# Altium schematic sheet EE311_Example_Boost_Sch.SchDoc: ELECTENG 311 - Boost Converter
size A3; Author: Duleepa J Thrimawithana; Organization: Power Electronics Group; Address1: The University of Auckland; Address2: 20 Symonds Street; Address3: Auckland 1010; Address4: New Zealand; Revision: 1R1; SheetNumber: 1; SheetTotal: 1
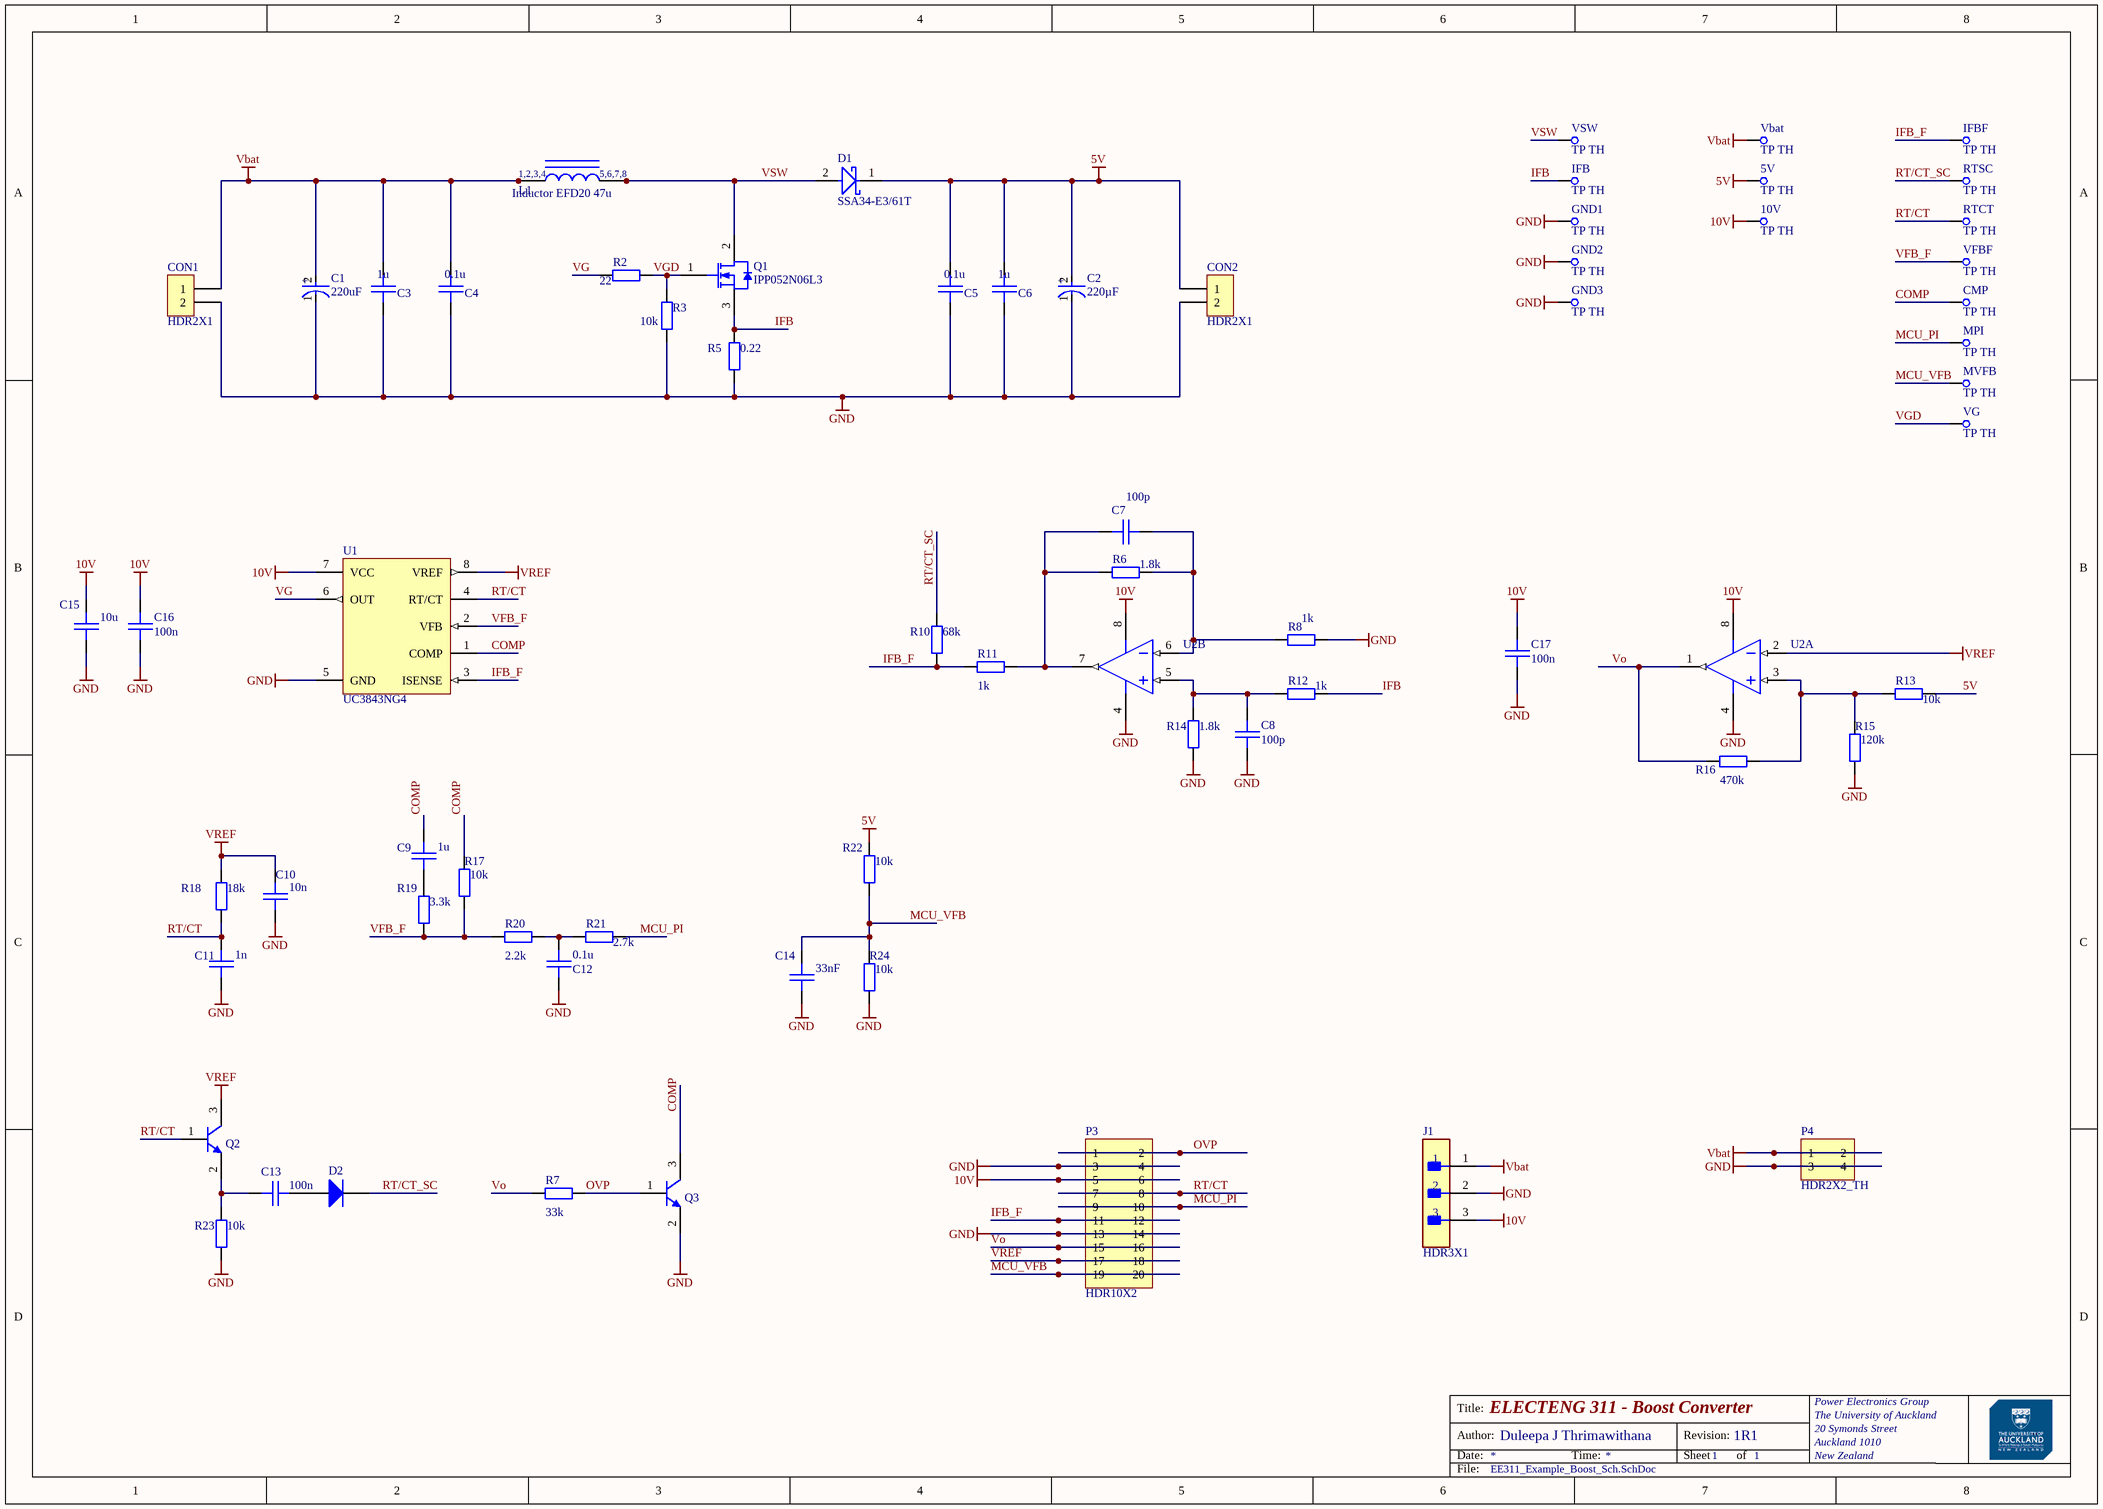
[diagram p0: EE311_Example_Boost_Sch.SchDoc]

## Parts
5V  TP TH  [TP_TH_2.5mm]
10V  TP TH  [TP_TH_2.5mm]
C1  value 220uF  [FP-FKF-MFG]  (hidden comment: EEE-FK1K330P)
C2  value 220µF  [FP-FKF-MFG]  (hidden comment: EEE-FK1K330P)
C3  1u  [C1210]
C4  0.1u  [C1210]
C5  0.1u  [C1210]
C6  1u  [C1210]
C7  value 100p  [C0805]  (hidden comment: CCAP0805)
C8  value 100p  [C0805]  (hidden comment: CCAP0805)
C9  value 1u  [C0805]  (hidden comment: CCAP0805)
C10  value 10n  [C0805]  (hidden comment: CCAP0805)
C11  value 1n  [C0805]  (hidden comment: CCAP0805)
C12  value 0.1u  [C0805]  (hidden comment: CCAP0805)
C13  value 100n  [C0805]  (hidden comment: CCAP0805)
C14  value 33nF  [C0805]  (hidden comment: CCAP0805)
C15  value 10u  [C0805]  (hidden comment: CCAP0805)
C16  value 100n  [C0805]  (hidden comment: CCAP0805)
C17  value 100n  [C0805]  (hidden comment: CCAP0805)
CMP  TP TH  [TP_TH_2.5mm]
CON1  HDR2X1  [HDR2X1_2P54]
CON2  HDR2X1  [HDR2X1_2P54]
D1  SSA34-E3/61T  [FP-95400-MFG]
D2  1N4148_SMT_SOD123  [SOD123]  (value not drawn)
GND1  TP TH  [TP_TH_3mm]
GND2  TP TH  [TP_TH_3mm]
GND3  TP TH  [TP_TH_3mm]
IFB  TP TH  [TP_TH_3mm]
IFBF  TP TH  [TP_TH_2.5mm]
J1  HDR3X1  [FP-22-28-4035-MFG]
L1  Inductor EFD20 47u  [EFD20]
MPI  TP TH  [TP_TH_2.5mm]
MVFB  TP TH  [TP_TH_2.5mm]
P3  HDR10X2  [HDR10X2_2P54]
P4  HDR2X2_TH  [HDR2X2_2P54_Male]
Q1  IPP052N06L3  [TO220VH]
Q2  MMBT2222A  [SOT23SM]  (value not drawn)
Q3  MMBT2222A  [SOT23SM]  (value not drawn)
R2  value 22  [R0805]  (hidden comment: RES0805)
R3  value 10k  [R0805]  (hidden comment: RES0805)
R5  value 0.22  [R1210]  (hidden comment: RES1210)
R6  value 1.8k  [R0805]  (hidden comment: RES0805)
R7  value 33k  [R0805]  (hidden comment: RES0805)
R8  value 1k  [R0805]  (hidden comment: RES0805)
R10  value 68k  [R0805]  (hidden comment: RES0805)
R11  value 1k  [R0805]  (hidden comment: RES0805)
R12  value 1k  [R0805]  (hidden comment: RES0805)
R13  value 10k  [R0805]  (hidden comment: RES0805)
R14  value 1.8k  [R0805]  (hidden comment: RES0805)
R15  value 120k  [R0805]  (hidden comment: RES0805)
R16  value 470k  [R0805]  (hidden comment: RES0805)
R17  value 10k  [R0805]  (hidden comment: RES0805)
R18  value 18k  [R0805]  (hidden comment: RES0805)
R19  value 3.3k  [R0805]  (hidden comment: RES0805)
R20  value 2.2k  [R0805]  (hidden comment: RES0805)
R21  value 2.7k  [R0805]  (hidden comment: RES0805)
R22  value 10k  [R0805]  (hidden comment: RES0805)
R23  value 10k  [R0805]  (hidden comment: RES0805)
R24  value 10k  [R0805]  (hidden comment: RES0805)
RTCT  TP TH  [TP_TH_2.5mm]
RTSC  TP TH  [TP_TH_2.5mm]
U1  UC3843NG4  [DIP-8]
U2  LT6221  [SOIC8]  (value not drawn)  (parts A,B of 2)
Vbat  TP TH  [TP_TH_2.5mm]
VFBF  TP TH  [TP_TH_2.5mm]
VG  TP TH  [TP_TH_2.5mm]
VSW  TP TH  [TP_TH_3mm]

## Nets
5V: 5V.1 C2.2(A) C5.2 C6.2 CON2.1 D1.1(C) R13.2 R22.2
10V: 10V.1 C15.1 C16.1 C17.1 J1.3 P3.5 P3.6 U1.7(VCC) U2.8(VDD)
GND: C1.1(C) C2.1(C) C3.1 C4.1 C5.1 C6.1 C8.2 C10.2 C11.2 C12.2 C14.2 C15.2 C16.2 C17.2 CON1.2 CON2.2 GND1.1 GND2.1 GND3.1 J1.2 P3.3 P3.4 P3.13 P3.14 P4.3 P4.4 Q3.2(E) R3.1 R5.1 R8.2 R14.1 R15.1 R23.2 R24.1 U1.5(GND) U2.4(GND)
Vbat: C1.2(A) C3.2 C4.2 CON1.1 J1.1 L1.1 L1.2 L1.3 L1.4 P4.1 P4.2 Vbat.1
VREF: C10.1 P3.17 P3.18 Q2.3(C) R18.2 U1.8(VREF) U2.2(IN1-)
COMP: C9.1 CMP.1 Q3.3(C) R17.2 U1.1(COMP)
IFB: IFB.1 Q1.3(SOURCE) R5.2 R12.2
IFB_F: IFBF.1 P3.11 P3.12 R10.2 R11.1 U1.3(ISENSE)
MCU_PI: MPI.1 P3.9 P3.10 R21.1
MCU_VFB: C14.1 MVFB.1 P3.19 P3.20 R22.1 R24.2
OVP: P3.1 P3.2 Q3.1(B) R7.2
RT/CT: C11.1 P3.7 P3.8 Q2.1(B) R18.1 RTCT.1 U1.4(RT/CT)
RT/CT_SC: D2.2(K) R10.1 RTSC.1
VFB_F: R17.1 R19.1 R20.2 U1.2(VFB) VFBF.1
VG: R2.1 U1.6(OUT)
VGD: Q1.1(GATE) R2.2 R3.2 VG.1
Vo: P3.15 P3.16 R7.1 R16.1 U2.1(OUT1)
VSW: D1.2(A) L1.5 L1.6 L1.7 L1.8 Q1.2(DRAIN) VSW.1
NetC7_1: C7.1 R6.1 R11.2 U2.7(OUT1)
NetC7_2: C7.2 R6.2 R8.1 U2.6(IN1-)
NetC8_1: C8.1 R12.1 R14.2 U2.5(IN1+)
NetC9_2: C9.2 R19.2
NetC12_1: C12.1 R20.1 R21.2
NetC13_1: C13.1 Q2.2(E) R23.1
NetC13_2: C13.2 D2.1(A)
NetR13_1: R13.1 R15.2 R16.2 U2.3(IN1+)

## Notes on the sheet
- Title:
- Author:
- Date:
- Time:
- Revision:
- Sheet
- of
- File:
- (in symbol CMP-001-00000-1) +
- (in symbol CMP-006-000001-2) 1,2,3,4; 5,6,7,8

## Library data of the parts
5V 10V CMP IFBF MPI MVFB RTCT RTSC Vbat VFBF VG = CMP-046-000000-3: Testpoint through hole / Keystone compact / 5000 - Red / 5001 - Black / 5002 - White / 5003 - Orange / 5004 - Yellow; Source: UoAPE_Connectors and Mechanical.SchLib; Design Item ID: TP TH
C1 C2 = CMP-001-00000-1: Aluminum Electrolytic Capacitor, Polarized, Aluminum (wet), 80V, 20% +Tol, 20% -Tol, 33uF, Surface Mount, 3333; Capacitor Type: Aluminium; Pins: 2; Case/Package: 3333; RoHS Compliant: Yes; Height: 10.2mm; Mounting Technology: Surface Mount; Min Operating Temperature: -55°C; Dielectric Material: Aluminium; Max Operating Temperature: 105°C
C3-C6 = CMP-003-000003-2: Capacitor 1210; Design Item ID: CCAP1210; Source: CommonSymbols_V1.SchLib
C7-C17 = CMP-003-000002-2: Capacitor 0805; Design Item ID: CCAP0805; Source: CommonSymbols_V1.SchLib
CON1 CON2 = CMP-004-000000-7: Header 2X1; Design Item ID: HDR2X1; Source: CommonSymbols_V1.SchLib
D1 = CMP-00006-3: Rectifier Diode, Schottky, 1 Phase, 1 Element, 3A, 40V V(RRM), Silicon, DO-214AC; Non-rep Pk Forward Current-Max: 75A; Polarity: Standard; Number of Elements: 1; Max Reverse Leakage Current: 200uA; Qualification Status: Not Qualified; Application(s): EFFICIENCY; Time @ Peak Reflow Temperature-Max (s): 40s; Forward Voltage: 490mV; Package Body Material: Plastic; Package Quantity: 1800; JEDEC-95 Code: DO-214AC; Max Reverse Voltage (DC): 40V; Length: 4.5mm; Moisture Sensitivity Level: 1; Packaging: Tape and Reel; Peak Reflow Temperature (Cel): 260°C; Terminal Finish: Tin; Technology: SCHOTTKY; Width: 2.79mm; Voltage Rating (DC): 40V; Number of Phases: 1; Reverse Voltage: 40V; Pins: 2; Peak Non-Repetitive Surge Current: 75A; Average Rectified Current: 3A; Terminal Form: C BEND; Rep Pk Reverse Voltage-Max: 40V; Diode Element Material: SILICON; Mounting Technology: Surface Mount; Max Reverse Current: 200uA; Series: -; Surface Mount: Yes; Package Shape: Rectangular; Package Style: SMALL OUTLINEMeter; Max Operating Temperature: 150°C; Max Forward Surge Current (Ifsm): 75A; RoHS Compliant: Yes; Current Rating: 3A; Lead Free: Lead Free; Forward Current: 3A; Min Operating Temperature: -65°C; Terminal Position: DUAL; Diode Type: RECTIFIER; Case/Package: SMA; Radiation Hardening: No; Max Repetitive Reverse Voltage (Vrrm): 40V; Max Output current: 3A; Output Current: 3A; Max Surge Current: 75A; JESD-30 Code: R-PDSO-C2; Height: 2.087mm; JESD-609 Code: e3; Reach SVHC Compliant: Unknown
D2 = CMP-004-00012-1: DIODE GEN PURP 100V 300MA SOD123; Manufacturer Part Number: 1N4148W-13-F; Manufacturer: Diodes Incorporated; Capacitance @ Vr, F: 2pF @ 0V, 1MHz; Speed: Small Signal =< 200mA (Io), Any Speed; Diode Type: Standard; Current - Average Rectified (Io): 150mA; Part Status: Active; Supplier Device Package: SOD-123; ComponentLink1Description: https://www.diodes.com/assets/Datasheets/ds30086.pdf; Pricing 1: 1=0.33, 10=0.292, 100=0.1586, 500=0.0976, 1000=0.06656 (NZD); Operating Temperature - Junction: -65°C ~ 150°C; Category: Discrete Semiconductor Products; Base Part Number: 1N4148W; RoHS: RoHS Compliant; Stock 1: 5282; Packaging: Cut Tape (CT); Pins: 2; Source: EE209_SchLib.SchLib; ComponentLink1URL: https://www.diodes.com/assets/Datasheets/ds30086.pdf; Mounting Type: Surface Mount; Case/Package: SOD-123; Component Type: Standard; Design Item ID: 1N4148_SMT_SOD123
GND1-GND3 IFB VSW = CMP-046-000000-4: Testpoint through hole / Keystone compact / 5000 - Red / 5001 - Black / 5002 - White / 5003 - Orange / 5004 - Yellow; Design Item ID: TP TH; Source: UoAPE_Connectors and Mechanical.SchLib
J1 = CMP-002-00030-1: 22-28-4035, Board Connector, 3 Contact(s), 1 Row(s), Male, Straight, 0.1 inch Pitch, Solder Terminal, Receptacle; Number Of PCB Rows: 1; Number of Contacts: 3; Mounting Technology: Board; Connector Type: BOARD CONNECTOR; RoHS Compliant: Yes; Contact Gender: Male; Min Operating Temperature: 0°C; Terminal Pitch: 2.54mm; Max Operating Temperature: 75°C
L1 = CMP-006-000001-2: Inductor with core; Design Item ID: Inductor EFD20; Source: CommonSymbols_V1.SchLib
P3 = CMP-004-000004-1: Header, 10-Pin, Dual row; Design Item ID: HDR10X2; Source: CommonSymbols_V1.SchLib
P4 = CMP-002-00008-6: Male Header, 4-Pin, Dual row; Source: CommonSymbols_V1.SchLib; Design Item ID: HDR2X2
Q1 = CMP-011-000031-1: N-Channel OptiMOS 3 Power-Transistor, 60 V VDS, 80 A ID, -55 to 175 degC, PG-TO220-3-1, Tube, Green; Manufacturer: Infineon; PartNumber: IPP052N06L3 G; RDS (on) (max) (@4.5V): 8.3 mOhm; VDS (max): 60 V; QG: 37 nC; ID (max): 80 A; Ptot (max): 115 W; RthJA (max): 62 K/W; Polarity: N; RDS (on) (max): 5 mOhm; VGS(th) (min): 1.2 V; Green: TRUE; RthJC (max): 1.3 K/W; IDpuls (max): 320 A; VGS(th) (max): 2.2 V; PackageReference: PG-TO220-3-1; Mounting Technology: Through Hole; ComponentLink3Description: Package Specification; Packing: Tube; ComponentLink1Description: Manufacturer URL; PackageDescription: 3-Pin Plastic (Green) Transistor Single Outline Package, 10.03 x 8.98 mm Body, 2.54 mm Pitch; ComponentLink3URL: http://www.infineon.com/dgdl/IPP028N08N3_Rev1%5B1%5D.0.pdf?folderId=db3a304313b8b5a60113cee8763b02d7&fileId=db3a30432313ff5e0123a3c08e7326b5; Design Item ID: IPP052N06L3; DatasheetVersion: Rev. 2.4; ComponentLink2URL: http://www.infineon.com/dgdl/IPP_B052N06L3_Rev2.4.pdf?folderId=db3a304313b8b5a60113cee8763b02d7&fileId=db3a30432313ff5e0123a32d97c125b6; PackageVersion: Rev. 05, 08/2007; ComponentLink2Description: Datasheet; Rth: 1.3 K/W; Source: CommonSymbols_V1.SchLib; Halogen-free: TRUE; ComponentLink1URL: http://www.infineon.com/
Q2 Q3 = CMP-011-000025-1: General Purpose Transistor, NPN Silicon, 3-Pin SOT-23, Pb-Free, Tape and Reel; PartNumber: MMBT2222ALT1G; Manufacturer: On Semiconductor; fT Min (MHz): 300; IC Continuous (A): 0.6; PackageVersion: Rev. AP, 11/2009; ComponentLink2Description: Datasheet; ComponentLink1Description: Manufacturer URL; Design Item ID: MMBT2222A; PackageDescription: 3-Pin Small Outline Transistor, Body 2.92 x 1.3 mm, Pitch 0.95 mm; RoHS: TRUE; ComponentLink1URL: http://www.onsemi.com/; DatasheetVersion: Rev. 10; Packing: Tape and Reel; Mounting Technology: Surface Mount; Polarity: NPN; ComponentLink2URL: http://www.onsemi.cn/pub_link/Collateral/MMBT2222LT1-D.PDF; Source: CommonSymbols_V1.SchLib; PackageReference: SOT-23-3-318-08; ComponentLink3Description: Package Specification; ComponentLink3URL: http://www.onsemi.cn/pub_link/Collateral/318-08.PDF
R2 R3 R6-R8 R10-R24 = CMP-010-000002-2: Resistor 0805; Design Item ID: RES0805; Source: CommonSymbols_V1.SchLib
R5 = CMP-009-00000-1: Resistor 1210; Design Item ID: RES1206; Source: CommonSymbols_V1.SchLib
U1 = CMP-019-00013-1: Single ended 500KHz current mode PWM controller with 8.4V/7.6V UVLO 100% duty cycle, 0C to 70C 8-PDIP 0 to 70; Manufacturer Lifecycle Status: ACTIVE; Rise Time: 50ns; Topology: Boost, Buck, Buck-Boost, Flyback; Nominal Supply Voltage: 25V; Number of Outputs: 1; Frequency: 450kHz; Output Voltage: 13.5V; Max Supply Voltage: 30V; Length: 9.81mm; Duty Cycle: 100%; Pins: 8; Lifecycle Status: Production; Lead Free: Lead Free; Width: 6.35mm; Height: 5.08mm; RoHS: Compliant; Clock Frequency: 500kHz; Case/Package: PDIP; Min Operating Temperature: 0°C; Thickness: 3.9mm; Fall Time: 50ns; Switching Frequency: 500kHz; Max Duty Cycle: 100%; Max Operating Temperature: 70°C; Weight: 528.605208mg
U2 = CMP-008-000000-4: IC OPAMP LT6221 DUAL SM; Manufactuer: Linear Technology; Manufacturer-PN: LT6221CS8#TRPBF; UoA Stock#: OPA000102; Assembly Method: Surface Mount; Path: ece/ts/Lists/Stock Inventory; Item Type: Item; Supplier2: Digikey; Source: CommonSymbols_V1.SchLib; Value: LT6221; Size/Package: S8; Status: Active; Supplier1: Arrow; Design Item ID: LT6221; Supplier2-PN: LT6221CS8#PBF-ND; Category: OpAmp; Supplier1-PN: LT6221CS8#TRPBF